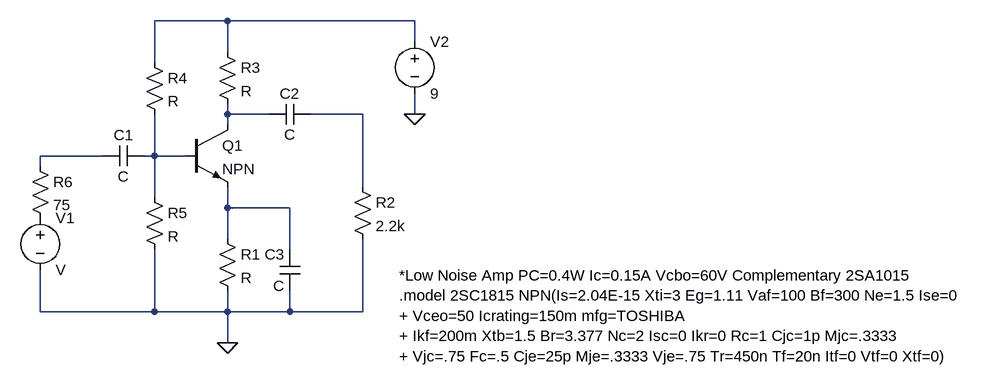
[diagram p0: schematic Draft13.asc]
Draft13.asc, the LTspice schematic file:
Version 4
SHEET 1 1728 852
WIRE 480 -48 368 -48
WIRE 768 -48 480 -48
WIRE 768 -16 768 -48
WIRE 480 0 480 -48
WIRE 368 16 368 -48
WIRE 480 96 480 80
WIRE 544 96 480 96
WIRE 688 96 608 96
WIRE 768 96 768 64
WIRE 480 112 480 96
WIRE 288 160 192 160
WIRE 368 160 368 96
WIRE 368 160 352 160
WIRE 416 160 368 160
WIRE 192 176 192 160
WIRE 688 208 688 96
WIRE 368 224 368 160
WIRE 480 240 480 208
WIRE 576 240 480 240
WIRE 480 288 480 240
WIRE 576 304 576 240
WIRE 192 400 192 336
WIRE 368 400 368 304
WIRE 368 400 192 400
WIRE 480 400 480 368
WIRE 480 400 368 400
WIRE 576 400 576 368
WIRE 576 400 480 400
WIRE 688 400 688 288
WIRE 688 400 576 400
WIRE 480 448 480 400
FLAG 768 96 0
FLAG 480 448 0
SYMBOL /voltage 192 240 R0
SYMATTR InstName V1
SYMBOL /voltage 768 -32 R0
SYMATTR InstName V2
SYMATTR Value 9
SYMBOL /res 464 272 R0
SYMATTR InstName R1
SYMBOL /res 672 192 R0
SYMATTR InstName R2
SYMATTR Value 2.2k
SYMBOL /res 464 -16 R0
SYMATTR InstName R3
SYMBOL /res 352 0 R0
SYMATTR InstName R4
SYMBOL /res 352 208 R0
SYMATTR InstName R5
SYMBOL /res 176 160 R0
SYMATTR InstName R6
SYMATTR Value 75
SYMBOL /cap 352 144 R90
WINDOW 0 0 32 VBottom 2
WINDOW 3 32 32 VTop 2
SYMATTR InstName C1
SYMBOL /cap 608 80 R90
WINDOW 0 0 32 VBottom 2
WINDOW 3 32 32 VTop 2
SYMATTR InstName C2
SYMBOL /cap 592 368 R180
WINDOW 0 24 56 Left 2
WINDOW 3 24 8 Left 2
SYMATTR InstName C3
SYMBOL /npn 416 112 R0
SYMATTR InstName Q1
TEXT 744 344 Left 2 !*Low Noise Amp PC=0.4W Ic=0.15A Vcbo=60V Complementary 2SA1015\n.model 2SC1815 NPN(Is=2.04E-15 Xti=3 Eg=1.11 Vaf=100 Bf=300 Ne=1.5 Ise=0\n+ Vceo=50 Icrating=150m mfg=TOSHIBA\n+ Ikf=200m Xtb=1.5 Br=3.377 Nc=2 Isc=0 Ikr=0 Rc=1 Cjc=1p Mjc=.3333\n+ Vjc=.75 Fc=.5 Cje=25p Mje=.3333 Vje=.75 Tr=450n Tf=20n Itf=0 Vtf=0 Xtf=0)

The netlist it stands for:
* Draft13.asc
V1 P001 0 V
V2 N001 0 9
R1 N006 0 R
R2 N003 0 2.2k
R3 N001 N002 R
R4 N001 N005 R
R5 N005 0 R
R6 N004 P001 75
C1 N005 N004 C
C2 N003 N002 C
C3 0 N006 C
Q1 N002 N005 N006 0 NPN
.model NPN NPN
.model PNP PNP
.lib standard.bjt
*Low Noise Amp PC=0.4W Ic=0.15A Vcbo=60V Complementary 2SA1015
.model 2SC1815 NPN(Is=2.04E-15 Xti=3 Eg=1.11 Vaf=100 Bf=300 Ne=1.5 Ise=0
+ Vceo=50 Icrating=150m mfg=TOSHIBA
+ Ikf=200m Xtb=1.5 Br=3.377 Nc=2 Isc=0 Ikr=0 Rc=1 Cjc=1p Mjc=.3333
+ Vjc=.75 Fc=.5 Cje=25p Mje=.3333 Vje=.75 Tr=450n Tf=20n Itf=0 Vtf=0 Xtf=0)
.backanno
.end